# Altium schematic sheet EPROM_Programmer_3.SchDoc: EPROM PROGRAMMER THROUGH MIICROCONTROLER
size A4; Author: L.JAOUANNE; Revision: v1.0; SheetNumber: 3; SheetTotal: 3
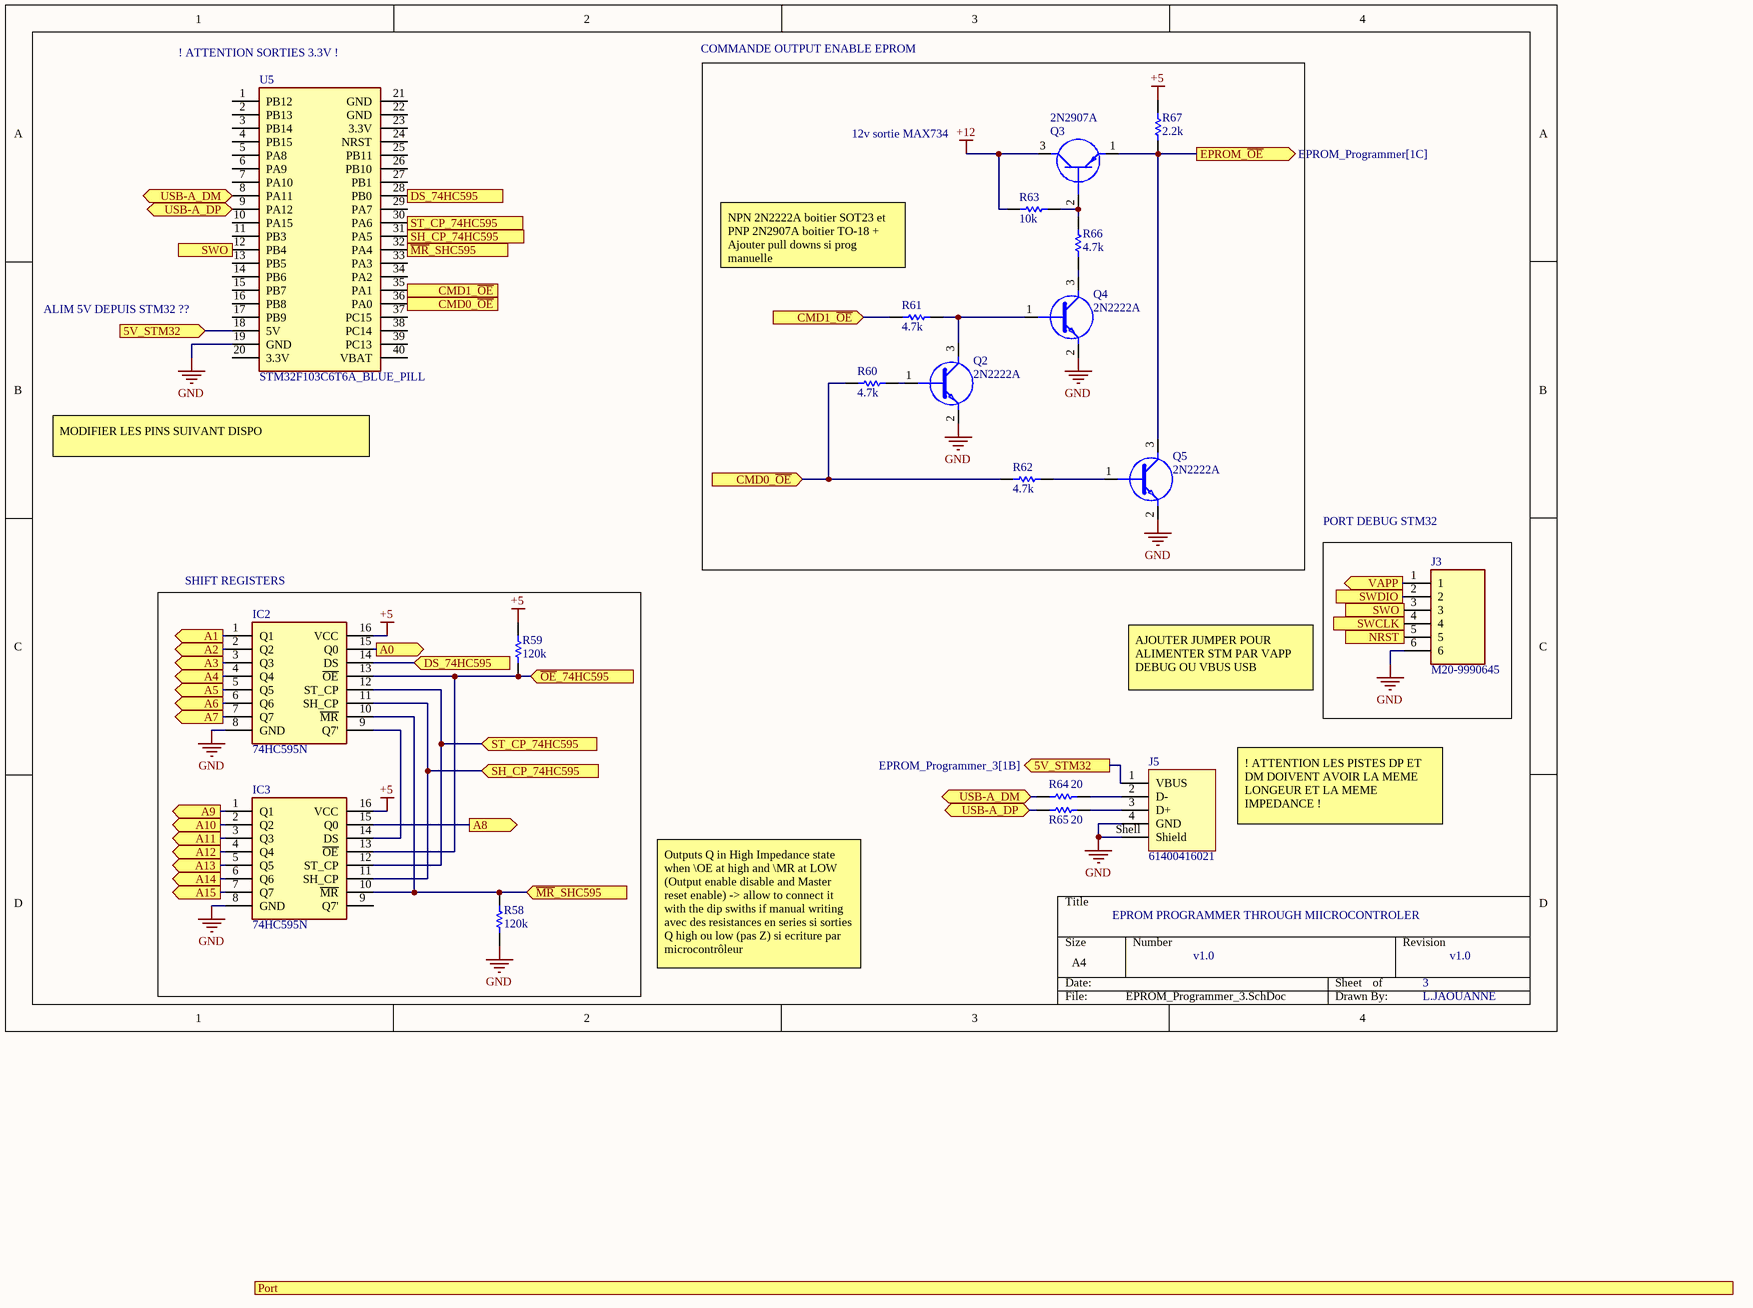
[diagram p0: EPROM_Programmer_3.SchDoc]

## Parts
IC2  74HC595N  [DIP762W53P254L1902H420Q16N]
IC3  74HC595N  [DIP762W53P254L1902H420Q16N]
J3  M20-9990645  [HDRV6W66P0X254_1X6_1524X254X874P]
J5  61400416021  [61400416021]
Q2  2N2222A  [SOT96P237X111-3N]
Q3  2N2907A  [CENTRAL_TO18]
Q4  2N2222A  [SOT96P237X111-3N]
Q5  2N2222A  [SOT96P237X111-3N]
R58  value 120k  [R0603]  (hidden comment: Res1)
R59  value 120k  [R0603]  (hidden comment: Res1)
R60  value 4.7k  [R0603]  (hidden comment: Res1)
R61  value 4.7k  [R0603]  (hidden comment: Res1)
R62  value 4.7k  [R0603]  (hidden comment: Res1)
R63  value 10k  [R0603]  (hidden comment: Res1)
R64  value 20  [R0603]  (hidden comment: Res1)
R65  value 20  [R0603]  (hidden comment: Res1)
R66  value 4.7k  [R0603]  (hidden comment: Res1)
R67  value 2.2k  [R0603]  (hidden comment: Res1)
U5  STM32F103C6T6A_BLUE_PILL  [TE_1-535541-8]

## Blocks framed on the sheet
PORT DEBUG STM32: J3
SHIFT REGISTERS: IC2 IC3 R58 R59

## Ports
5V_STM32 (in, see EPROM_Programmer_3[3C]), 5V_STM32 (out, see EPROM_Programmer_3[1B]), A0 (out, see EPROM_Programmer[1C], EPROM_Programmer[4B]), A1 (out, see EPROM_Programmer[1C], EPROM_Programmer[4B]), A2 (out, see EPROM_Programmer[1C], EPROM_Programmer[4B]), A3 (out, see EPROM_Programmer[1C], EPROM_Programmer[4B]), A4 (out, see EPROM_Programmer[1C], EPROM_Programmer[4B]), A5 (out, see EPROM_Programmer[1C], EPROM_Programmer[4B]), A6 (out, see EPROM_Programmer[1D], EPROM_Programmer[4B]), A7 (out, see EPROM_Programmer[1D], EPROM_Programmer[4B]), A8 (out, see EPROM_Programmer[1D], EPROM_Programmer[4A]), A9 (out, see EPROM_Programmer[1D], EPROM_Programmer[4A]), A10 (out, see EPROM_Programmer[1D], EPROM_Programmer[4A]), A11 (out, see EPROM_Programmer[1D], EPROM_Programmer[4A]), A12 (out, see EPROM_Programmer[1D], EPROM_Programmer[4A]), A13 (out, see EPROM_Programmer[1D], EPROM_Programmer[4A]), A14 (out, see EPROM_Programmer[1D], EPROM_Programmer[4A]), A15 (out, see EPROM_Programmer[1D], EPROM_Programmer[4A]), CMD0_~{OE} (in, see EPROM_Programmer_3[2B]), CMD0_~{OE} (out, see EPROM_Programmer_3[2B]), CMD1_~{OE} (in, see EPROM_Programmer_3[2B]), CMD1_~{OE} (out, see EPROM_Programmer_3[2B]), DS_74HC595 (in, see EPROM_Programmer_3[2A]), DS_74HC595 (out, see EPROM_Programmer_3[2C]), EPROM_~{OE} (out, see EPROM_Programmer[1C]), NRST, Port, SH_CP_74HC595 (in, see EPROM_Programmer_3[2A]), SH_CP_74HC595 (out, see EPROM_Programmer_3[2C]), ST_CP_74HC595 (in, see EPROM_Programmer_3[2A]), ST_CP_74HC595 (out, see EPROM_Programmer_3[2C]), SWCLK (out), SWDIO, SWO (see EPROM_Programmer_3[1A]), SWO (see EPROM_Programmer_3[4C]), USB-A_DM (bidir, see EPROM_Programmer_3[1A]), USB-A_DM (bidir, see EPROM_Programmer_3[3D]), USB-A_DP (bidir, see EPROM_Programmer_3[1A]), USB-A_DP (bidir, see EPROM_Programmer_3[3D]), VAPP (out), ~{MR}_SHC595 (in, see EPROM_Programmer_3[2A]), ~{MR}_SHC595 (out, see EPROM_Programmer_3[2D]), ~{OE}_74HC595 (in)

## Nets
+5: IC2.16(VCC) IC3.16(VCC) R59.1 R67.2
+12: Q3.3(C) R63.2
GND: IC2.8(GND) IC3.8(GND) J3.6 J5.4(GND) J5.Shell(Shield) Q2.2(E) Q4.2(E) Q5.2(E) R58.2 U5.19(GND)
5V_STM32: J5.1(VBUS) U5.18(5V) ; port 5V_STM32
A0: IC2.15(Q0) ; port A0
A1: IC2.1(Q1) ; port A1
A2: IC2.2(Q2) ; port A2
A3: IC2.3(Q3) ; port A3
A4: IC2.4(Q4) ; port A4
A5: IC2.5(Q5) ; port A5
A6: IC2.6(Q6) ; port A6
A7: IC2.7(Q7) ; port A7
A8: IC3.15(Q0) ; port A8
A9: IC3.1(Q1) ; port A9
A10: IC3.2(Q2) ; port A10
A11: IC3.3(Q3) ; port A11
A12: IC3.4(Q4) ; port A12
A13: IC3.5(Q5) ; port A13
A14: IC3.6(Q6) ; port A14
A15: IC3.7(Q7) ; port A15
CMD0_~{OE}: R60.2 R62.2 U5.36(PA0) ; port CMD0_~{OE}
CMD1_~{OE}: R61.2 U5.35(PA1) ; port CMD1_~{OE}
DS_74HC595: IC2.14(DS) U5.28(PB0) ; port DS_74HC595
EPROM_~{OE}: Q3.1(E) Q5.3(C) R67.1 ; port EPROM_~{OE}
~{MR}_SHC595: IC2.10(~{MR}) IC3.10(~{MR}) R58.1 U5.32(PA4) ; port ~{MR}_SHC595
NRST: J3.5 ; port NRST
~{OE}_74HC595: IC2.13(~{OE}) IC3.13(~{OE}) R59.2 ; port ~{OE}_74HC595
SH_CP_74HC595: IC2.11(SH_CP) IC3.11(SH_CP) U5.31(PA5) ; port SH_CP_74HC595
ST_CP_74HC595: IC2.12(ST_CP) IC3.12(ST_CP) U5.30(PA6) ; port ST_CP_74HC595
SWCLK: J3.4 ; port SWCLK
SWDIO: J3.2 ; port SWDIO
SWO: J3.3 U5.12(PB4) ; port SWO
USB-A_DM: R64.1 U5.8(PA11) ; port USB-A_DM
USB-A_DP: R65.1 U5.9(PA12) ; port USB-A_DP
VAPP: J3.1 ; port VAPP
NetIC2_9: IC2.9(Q7') IC3.14(DS)
NetJ5_2: J5.2(D-) R64.2
NetJ5_3: J5.3(D+) R65.2
NetQ2_1: Q2.1(B) R60.1
NetQ2_3: Q2.3(C) Q4.1(B) R61.1
NetQ3_2: Q3.2(B) R63.1 R66.2
NetQ4_3: Q4.3(C) R66.1
NetQ5_1: Q5.1(B) R62.1

Not connected (* = marked no-connect by the designer): IC3 9(Q7'); U5 1(PB12) 2(PB13) 3(PB14) 4(PB15) 5(PA8) 6(PA9) 7(PA10) 10(PA15) 11(PB3) 13(PB5) 14(PB6) 15(PB7) 16(PB8) 17(PB9) 20(3.3V) 21(GND) 22(GND) 23(3.3V) 24(NRST) 25(PB11) 26(PB10) 27(PB1) 29(PA7) 33(PA3) 34(PA2) 37(PC15) 38(PC14) 39(PC13) 40(VBAT)

## Notes on the sheet
- (near U5) ! ATTENTION SORTIES 3.3V !
- COMMANDE OUTPUT ENABLE EPROM
- 12v sortie MAX734
- ALIM 5V DEPUIS STM32 ??
- (near R61) NPN 2N2222A boitier SOT23 et PNP 2N2907A boitier TO-18 + Ajouter pull downs si prog manuelle
- MODIFIER LES PINS SUIVANT DISPO
- AJOUTER JUMPER POUR ALIMENTER STM PAR VAPP DEBUG OU VBUS USB
- ! ATTENTION LES PISTES DP ET DM DOIVENT AVOIR LA MEME LONGEUR ET LA MEME IMPEDANCE !
- Outputs Q in High Impedance state when \OE at high and \MR at LOW (Output enable disable and Master reset enable) -> allow to connect it with the dip swiths if manual writing avec des resistances en series si sorties Q high ou low (pas Z) si ecriture par microcontrôleur

## Library data of the parts
IC2 IC3 = 74HC595N: Integrated Circuit; Manufacturer_Name: NXP; Datasheet Link: https://datasheet.datasheetarchive.com/originals/distributors/SFDatasheet-4/sf-00080087.pdf; Height: 4.2mm; Manufacturer_Part_Number: 74HC595N
J3 = M20-9990645: Connector; Manufacturer_Name: Harwin; Datasheet Link: https://cdn.harwin.com/pdfs/M20-999.pdf; Height: 8.74mm; Manufacturer_Part_Number: M20-9990645; Mouser Part Number: 855-M20-9990645; Mouser Price/Stock: https://www.mouser.co.uk/ProductDetail/Harwin/M20-9990645?qs=Jph8NoUxIfWe7BJQOhiVRg%3D%3D
J5 = CMP-1502-03227-2: NexarPartId: 21041530; Contact Resistance: 20mΩ; Gender: Receptacle; Voltage Rating (DC): 30V; Current Rating: 1.5A; Connector Type: USB; Insulation Resistance: 1GΩ; USB Standard: USB 2.0; Number of Contacts: 4; Number of Ports: 1; Width: 14.4mm; REACH SVHC: Unknown; Contact Plating: Gold; Length: 15.8mm; Lead Free: Lead Free; Max Operating Temperature: 105°C; Orientation: Horizontal; Contact Material: Copper; Voltage Rating: 30V; Min Operating Temperature: -40°C; Flammability Rating: UL94 V-0; Color: White; RoHS: Compliant; Number of Pins: 4; Mount: Horizontal, Through Hole; Number of Positions: 4; Operating Supply Voltage: 30V; Insulation Material: PBT; Termination: Solder
Q2 Q4 Q5 = 2N2222A: Boitier SOT23 -v MMBT2222ALT3G; Manufacturer_Name: onsemi; Geometry.Height: 1.11mm; Manufacturer_Part_Number: MMBT2222ALT3G; Mouser Part Number: 863-MMBT2222ALT3G; Mouser Price/Stock: https://www.mouser.co.uk/ProductDetail/onsemi/MMBT2222ALT3G?qs=R2UZ7gjkEjJUeR4kVVA5Qw%3D%3D; Arrow Part Number: MMBT2222ALT3G; Arrow Price/Stock: https://www.arrow.com/en/products/mmbt2222alt3g/on-semiconductor?utm_currency=USD&region=nac; Datasheet Link: http://www.onsemi.com/pub/Collateral/MMBT2222LT1-D.PDF
Q3 = 2N2907A: Transistor BJT PNP; Manufacturer_Name: Central Semiconductor; Datasheet Link: https://www.centralsemi.com/get_document.php?cmp=1&mergetype=pd&mergepath=pd&pdf_id=2n2906.PDF; Manufacturer_Part_Number: 2N2907A; Mouser Part Number: 610-2N2907A; Mouser Price/Stock: https://www.mouser.com/Search/Refine.aspx?Keyword=610-2N2907A
R58-R67 = Res1: Resistor; PackageReference: AXIAL-0.3; PackageDescription: Axial Device, Thru-Hole; 2 Leads; 0.3 in Pin Spacing
U5 = STM32F103_BLUE_PILL